# EAGLE schematic TSAL_inv_meas (EAGLE 9.6.2)
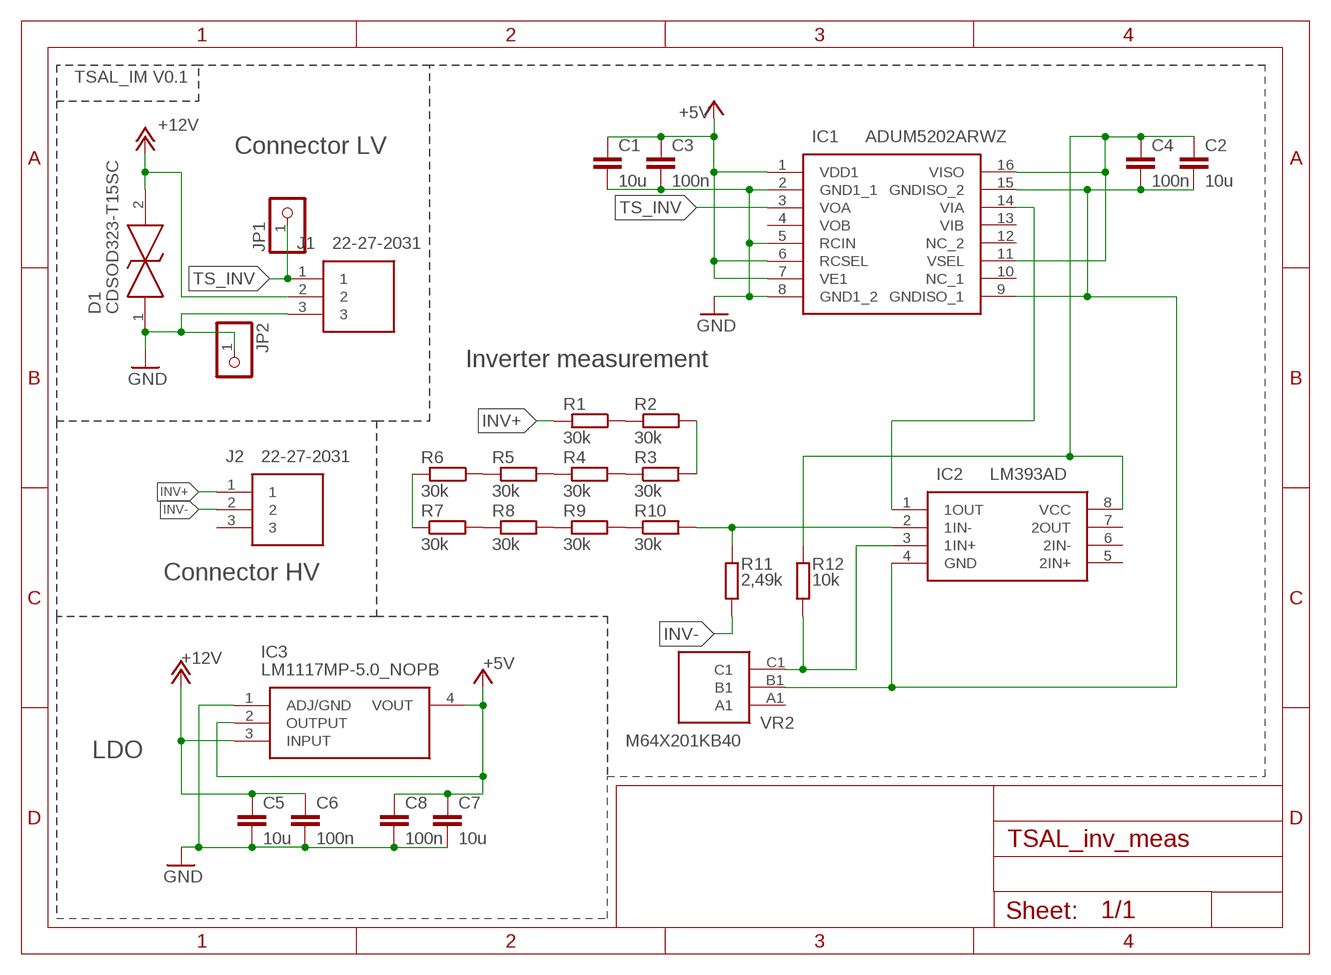
[diagram p0: schematic, sheet 1]

## Parts
C1  10u  C-EUC1206  [C1206]
C2  10u  C-EUC1206  [C1206]
C3  100n  C-EUC0603  [C0603]
C4  100n  C-EUC0603  [C0603]
C5  10u  C-EUC1206  [C1206]
C6  100n  C-EUC0603  [C0603]
C7  10u  C-EUC1206  [C1206]
C8  100n  C-EUC0603  [C0603]
D1  CDSOD323-T15SC  [SOD-323]
IC1  ADUM5202ARWZ  [SOIC127P1032X265-16N]
IC2  LM393AD  [SOIC127P600X175-8N]
IC3  LM1117MP-5.0_NOPB  [SOT230P700X180-4N]
J1  22-27-2031  [SHDR3W64P0X254_1X3_762X580X111]
J2  22-27-2031  [SHDR3W64P0X254_1X3_762X580X111]
JP1  PINHD-1X1  [1X01]
JP2  PINHD-1X1  [1X01]
R1  30k  R-EU_R1206  [R1206]
R2  30k  R-EU_R1206  [R1206]
R3  30k  R-EU_R1206  [R1206]
R4  30k  R-EU_R1206  [R1206]
R5  30k  R-EU_R1206  [R1206]
R6  30k  R-EU_R1206  [R1206]
R7  30k  R-EU_R1206  [R1206]
R8  30k  R-EU_R1206  [R1206]
R9  30k  R-EU_R1206  [R1206]
R10  30k  R-EU_R1206  [R1206]
R11  2,49k  R-EU_R0603  [R0603]
R12  10k  R-EU_R0603  [R0603]
VR2  M64X201KB40  [M64X201KB40]

## Nets
+5V [5V]: C1.1 C3.1 C7.1 C8.1 IC1.1(VDD1) IC1.6(RCSEL) IC1.7(VE1) IC3.2(OUTPUT) IC3.4(VOUT)
+12V [12V]: C5.1 C6.1 D1.2 IC3.3(INPUT) J1.2
GND [GND]: C1.2 C3.2 C5.2 C6.2 C7.2 C8.2 D1.1 IC1.2(GND1_1) IC1.5(RCIN) IC1.8(GND1_2) IC3.1(ADJ/GND) J1.3 JP2.1
INV+ [30V]: J2.1 R1.2
INV- [30V]: J2.2 R11.2
N$1 [5V]: R6.2 R7.1
N$2 [5V]: C2.1 C4.1 IC1.11(VSEL) IC1.16(VISO) IC2.8(VCC) R12.1
N$3 [30V]: R1.1 R2.2
N$4 [30V]: R2.1 R3.2
N$5 [30V]: R3.1 R4.2
N$6 [30V]: R4.1 R5.2
N$8 [30V]: R7.2 R8.1
N$9 [30V]: R8.2 R9.1
N$10 [30V]: R9.2 R10.1
N$11 [30V]: R5.1 R6.1
N$12 [30V]: IC2.2(1IN-) R10.2 R11.1
N$13 [5V]: IC2.3(1IN+) R12.2 VR2.C1
N$24 [5V]: IC1.14(VIA) IC2.1(1OUT)
N$27 [5V]: C2.2 C4.2 IC1.9(GNDISO_1) IC1.15(GNDISO_2) IC2.4(GND) VR2.B1
TS_INV [5V]: IC1.3(VOA) J1.1 JP1.1
Unconnected: IC1.4(VOB) IC1.10(NC_1) IC1.12(NC_2) IC1.13(VIB) IC2.5(2IN+) IC2.6(2IN-) IC2.7(2OUT) J2.3 VR2.A1

## Notes on the sheet
- TSAL_IM V0.1
- Connector LV
- Inverter measurement
- Connector HV
- LDO

## Library data of the parts
C1-C8 = rcl:C-EU: CAPACITOR, European symbol; SPICEPREFIX: C
D1 = SamacSys_Parts:CDSOD323-T15SC: TVS Diode ESD 15V BiDirectional SOD323 Bourns CDSOD323-T15SC Bi-Directional TVS Diode, 400W peak, 2-Pin SOD-323 Source: Datasheet <http://uk.rs-online.com/web/p/products/7734570>; ALLIED_NUMBER: 70410859; DESCRIPTION: TVS Diode ESD 15V BiDirectional SOD323 Bourns CDSOD323-T15SC Bi-Directional TVS Diode, 400W peak, 2-Pin SOD-323; HEIGHT: mm; MANUFACTURER_NAME: Bourns; MANUFACTURER_PART_NUMBER: CDSOD323-T15SC; RS_PART_NUMBER: 7734570; RS_PRICE-STOCK: http://uk.rs-online.com/web/p/products/7734570
IC1 = SamacSys_Parts:ADUM5202ARWZ: Digital Isolator 2-channel SOIC16 Source: Datasheet <http://docs-emea.rs-online.com/webdocs/0e48/0900766b80e48186.pdf>; ARROW_PART_NUMBER: ADUM5202ARWZ; ARROW_PRICE-STOCK: https://www.arrow.com/en/products/adum5202arwz/analog-devices; DESCRIPTION: Digital Isolator 2-channel SOIC16; HEIGHT: 2.65mm; MANUFACTURER_NAME: Analog Devices; MANUFACTURER_PART_NUMBER: ADUM5202ARWZ; MOUSER_PART_NUMBER: 584-ADUM5202ARWZ; MOUSER_PRICE-STOCK: https://www.mouser.com/Search/Refine.aspx?Keyword=584-ADUM5202ARWZ
IC2 = SamacSys_Parts:LM393AD: LM393ADG4, Dual Comparator Open Collector 1.3s 2-kanalers 3, 5, 9, 12, 15, 18, 24, 28V 8-Pin SOIC Source: Datasheet <http://uk.rs-online.com/web/p/products/5171905P>; DESCRIPTION: LM393ADG4, Dual Comparator Open Collector 1.3s 2-kanalers 3, 5, 9, 12, 15, 18, 24, 28V 8-Pin SOIC; HEIGHT: 1.75mm; MANUFACTURER_NAME: Texas Instruments; MANUFACTURER_PART_NUMBER: LM393AD; RS_PART_NUMBER: 5171905P; RS_PRICE-STOCK: http://uk.rs-online.com/web/p/products/5171905P
IC3 = SamacSys_Parts:LM1117MP-5.0_NOPB: LM1117MP-5.0/NOPB, Low Dropout Voltage Regulator, 1.5A, 5 V +/-1%, 4-Pin SOT-223 Source: Datasheet <https://datasheet.datasheetarchive.com/originals/distributors/Datasheets-SFU2/DSASFU100036103.pdf>; ARROW_PART_NUMBER: LM1117MP-5.0/NOPB; ARROW_PRICE-STOCK: https://www.arrow.com/en/products/lm1117mp-5.0nopb/texas-instruments?region=nac; DESCRIPTION: LM1117MP-5.0/NOPB, Low Dropout Voltage Regulator, 1.5A, 5 V +/-1%, 4-Pin SOT-223; HEIGHT: 1.8mm; MANUFACTURER_NAME: Texas Instruments; MANUFACTURER_PART_NUMBER: LM1117MP-5.0/NOPB; MOUSER_PART_NUMBER: 926-LM1117MP-5.0NOPB; MOUSER_PRICE-STOCK: https://www.mouser.co.uk/ProductDetail/Texas-Instruments/LM1117MP-50-NOPB?qs=X1J7HmVL2ZFGlzwnAaPsKg%3D%3D
J1 J2 = SamacSys_Parts:22-27-2031: 3way straight PCB header w/friction lock Molex KK Series, Series Number 6410, 2.54mm Pitch 3 Way 1 Row Straight PCB Header, Solder Termination, 4A Source: Datasheet <http://uk.rs-online.com/web/p/products/4838477P>; ALLIED_NUMBER: 70190935; DESCRIPTION: 3way straight PCB header w/friction lock Molex KK Series, Series Number 6410, 2.54mm Pitch 3 Way 1 Row Straight PCB Header, Solder Termination, 4A; HEIGHT: 11.18mm; MANUFACTURER_NAME: Molex; MANUFACTURER_PART_NUMBER: 22-27-2031; RS_PART_NUMBER: 4838477P; RS_PRICE-STOCK: http://uk.rs-online.com/web/p/products/4838477P
JP1 JP2 = pinhead:PINHD-1X1: PIN HEADER
R1-R12 = rcl:R-EU_: RESISTOR, European symbol; SPICEPREFIX: R
VR2 = SamacSys_Parts:M64X201KB40: Trimmer Resistors - Through Hole 3/8"SQ 200ohms Multi Turn Cermet Source: Datasheet <https://www.mouser.co.uk/datasheet/2/427/64-239937.pdf>; ARROW_PART_NUMBER: M64X201KB40; ARROW_PRICE-STOCK: https://www.arrow.com/en/products/m64x201kb40/vishay; DESCRIPTION: Trimmer Resistors - Through Hole 3/8"SQ 200ohms Multi Turn Cermet; HEIGHT: 9.8mm; MANUFACTURER_NAME: Vishay; MANUFACTURER_PART_NUMBER: M64X201KB40; MOUSER_PART_NUMBER: 594-64X201; MOUSER_PRICE-STOCK: https://www.mouser.com/Search/Refine.aspx?Keyword=594-64X201

## Net classes
1 GND: width 0.5 mm, drill 0.35 mm, clearance 0.051 mm
2 5V: width 0.3 mm, drill 0.35 mm, clearance 0.051 mm
3 12V: width 0.5 mm, drill 0.35 mm, clearance 0.051 mm
4 30V: width 0.8 mm, drill 0.35 mm, clearance 0.051 mm